# Altium schematic sheet BopIt.SchDoc
size A; SheetNumber: 1; SheetTotal: 1
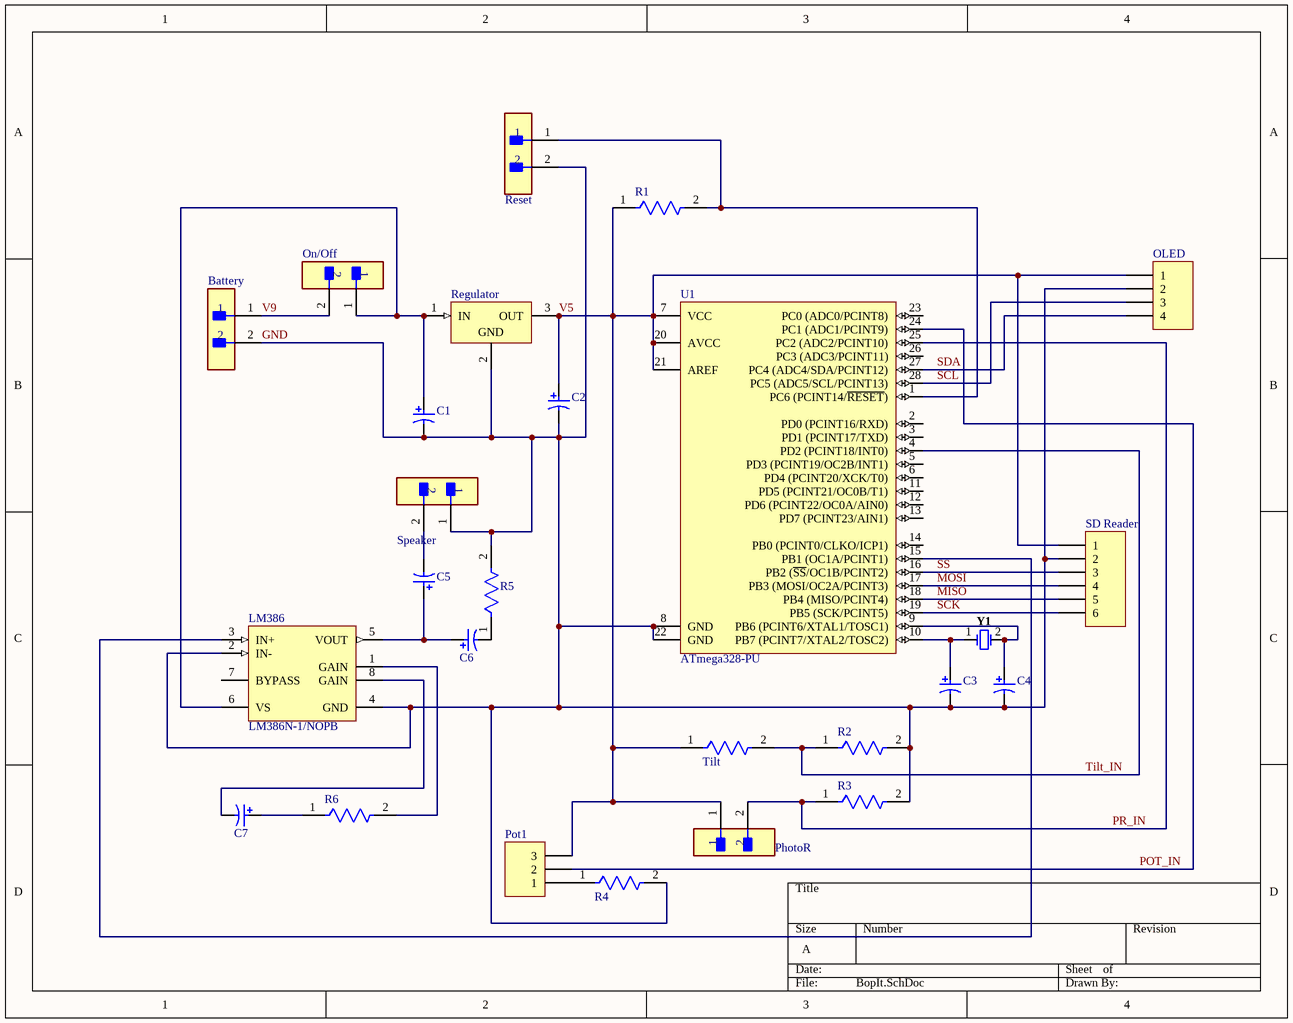
[diagram p0: BopIt.SchDoc]

## Parts
Battery  M22-2510205  [FP-M22-2510205-MFG]  (value not drawn)
C1  ECA1HM100  [CAPPR55-200-1100X500X1200]  (value not drawn)
C2  ECA1HM100  [CAPPR55-200-1100X500X1200]  (value not drawn)
C3  ECA1HM100  [CAPPR55-200-1100X500X1200]  (value not drawn)
C4  ECA1HM100  [CAPPR55-200-1100X500X1200]  (value not drawn)
C5  ECA-1VM221  [PNSC-ECA-1VM221-2]  (value not drawn)
C6  ECA1HM100  [CAPPR55-200-1100X500X1200]  (value not drawn)
C7  ECA1HM100  [CAPPR55-200-1100X500X1200]  (value not drawn)
LM386  LM386N-1/NOPB  [P0008A]
OLED  (no value)  [HDR1X4]
On/Off  M22-2510205  [FP-M22-2510205-MFG]  (value not drawn)
PhotoR  M22-2510205  [FP-M22-2510205-MFG]  (value not drawn)
Pot1  Header 3  [HDR1X3]  (value not drawn)
R1  CF18JT10K0  [FP-CF18-MFG]  (value not drawn)
R2  CF18JT10K0  [FP-CF18-MFG]  (value not drawn)
R3  CF18JT10K0  [FP-CF18-MFG]  (value not drawn)
R4  CF18JT10K0  [FP-CF18-MFG]  (value not drawn)
R5  CF18JT10K0  [FP-CF18-MFG]  (value not drawn)
R6  CF18JT10K0  [FP-CF18-MFG]  (value not drawn)
Regulator  LM7805CT  [FAIR-TO-220-3]  (value not drawn)
Reset  M22-2510205  [FP-M22-2510205-MFG]  (value not drawn)
SD_Reader  Header 6  [HDR1X6]  (value not drawn)
Speaker  M22-2510205  [FP-M22-2510205-MFG]  (value not drawn)
Tilt  CF18JT10K0  [FP-CF18-MFG]  (value not drawn)
U1  ATmega328-PU  [28P3]
Y1  FOXSLF/160-20  [FOX-FOXSLF160-20]  (value not drawn)

## Nets
GND: Battery.2 C1.2 C2.2 C3.2 C4.2 LM386.2(IN-) LM386.4(GND) OLED.2 R2.2 R3.2 R4.2 R5.2 Regulator.2(GND) Reset.2 SD_Reader.2 Speaker.1 U1.8(GND) U1.22(GND)
MISO: SD_Reader.5 U1.18(PB4_(MISO/PCINT4))
MOSI: SD_Reader.4 U1.17(PB3_(MOSI/OC2A/PCINT3))
POT_IN: Pot1.2 U1.24(PC1_(ADC1/PCINT9))
PR_IN: PhotoR.2 R3.1 U1.25(PC2_(ADC2/PCINT10))
SCK: SD_Reader.6 U1.19(PB5_(SCK/PCINT5))
SCL: OLED.3 U1.28(PC5_(ADC5/SCL/PCINT13))
SDA: OLED.4 U1.27(PC4_(ADC4/SDA/PCINT12))
SS: SD_Reader.3 U1.16(PB2_(~{SS}/OC1B/PCINT2))
Tilt_IN: R2.1 Tilt.2 U1.4(PD2_(PCINT18/INT0))
V5: C2.1 OLED.1 PhotoR.1 Pot1.3 R1.1 Regulator.3(OUT) SD_Reader.1 Tilt.1 U1.7(VCC) U1.20(AVCC) U1.21(AREF)
V9: Battery.1 On/Off.2
NetC1_1: C1.1 LM386.6(VS) On/Off.1 Regulator.1(IN)
NetC3_1: C3.1 U1.10(PB7_(PCINT7/XTAL2/TOSC2)) Y1.1
NetC4_1: C4.1 U1.9(PB6_(PCINT6/XTAL1/TOSC1)) Y1.2
NetC5_1: C5.1 C6.1 LM386.5(VOUT)
NetC5_2: C5.2 Speaker.2
NetC6_2: C6.2 R5.1
NetC7_1: C7.1 R6.1
NetC7_2: C7.2 LM386.8(GAIN)
NetLM386_1: LM386.1(GAIN) R6.2
NetLM386_3: LM386.3(IN+) U1.15(PB1_(OC1A/PCINT1))
NetPot1_1: Pot1.1 R4.1
NetR1_2: R1.2 Reset.1 U1.1(PC6_(PCINT14/~{RESET}))

Not connected (* = marked no-connect by the designer): LM386 7(BYPASS); U1 2(PD0_(PCINT16/RXD)) 3(PD1_(PCINT17/TXD)) 5(PD3_(PCINT19/OC2B/INT1)) 6(PD4_(PCINT20/XCK/T0)) 11(PD5_(PCINT21/OC0B/T1)) 12(PD6_(PCINT22/OC0A/AIN0)) 13(PD7_(PCINT23/AIN1)) 14(PB0_(PCINT0/CLKO/ICP1)) 23(PC0_(ADC0/PCINT8)) 26(PC3_(ADC3/PCINT11))

## Library data of the parts
Battery On/Off PhotoR Reset Speaker = CMP-15831-000005-1: CONN HEADER VERT 2POS 2MM; Manufacturer: Harwin; Conn Gender: Male; Current Rating: 2A; Number Of Contacts: 2; Conn Orientation: Vertical; Temperature Range Low: -40°C; Device Class L1: Connectors; ComponentLink2URL: https://cdn.harwin.com/pdfs/C018XX_M22_Series_Connectors.pdf; Temperature Range High: +105°C; Pitch: 2mm; Number Of Rows: 1; Temperature: -40°C to +105°C; Automotive: No; Device Class L3: unset; Octopart: https://octopart.com/m22-2510205-harwin-2538221; Mouser Description: Headers & Wire Housings 2 PIN SIL VERTICAL GOLD PIN HEADER; Height: 5.45mm; Category: Conn; Digikey Description: CONN HEADER VERT 2POS 2MM; Contact Material: Gold,Nickel; Lead Free: Yes; ComponentLink2Description: Datasheet; Manufacturer Part Number: M22-2510205; Device Class L2: Headers and Wire Housings; Package: 0; Footprint Url: https://cdn.harwin.com/pdfs/M22-251.pdf; RoHS: TRUE
C1-C4 C6 C7 = CMP-1665-00038-2: Aluminum Electrolytic Capacitor, 10 uF, +/- 20%, 50 V, -40 to 85 degC, 2-Pin THD, RoHS, Bulk; Manufacturer: Panasonic; Life (Hours): 2000Hour; Lead/Base Style: Straight; Dissipation Factor: 0.12%; Capacitance: 10uF; Leakage Current: 3uA; Dielectric Material: Aluminium; Lead Diameter: 0.5mm; Voltage Rating: 50V; Ripple Current: 65mA; Package Reference: CAPPR55-200-1100X500X1200; Height: 11mm; Diameter: 5mm; REACH SVHC: NoSVHC; Mount: ThroughHole; Packaging: Bulk; Manufacturer URL: http://www.panasonic.com/; Termination: Radial; Datasheet URL: https://industrial.panasonic.com/cdbs/www-data/pdf/RDF0000/ABA0000C1218.pdf; Lead Free: LeadFree; Height - Seated (Max): 0.472inch; Case/Package: Radial; Package Description: 2-Pin Radial Lead, Dia 5 mm, Height 12 mm; Tolerance: 20%; Datasheet Version: Rev. 05, 10/2016; Package Quantity: 200; Ripple Current (AC): 65mA; Min Operating Temperature: -40degC; RoHSCompliant: true; Number of Pins: 2; Max Operating Temperature: 85degC; Voltage: 50V; Lead Pitch: 2mm; Radiation Hardening: No; Voltage Rating (DC): 50V; Length: 11mm
C5 = CMP-2000-05311-1: Aluminum Electrolytic Capacitor, 220 uF, +/- 20%, 35 V, -40 to 85 degC, 2-Pin THD, RoHS, Bulk; Manufacturer: Panasonic; Lifetime@Temperature: 2000Hrs@85degC; Rated Voltage: 35V; Ripple Current: 350mA; Type: Radial; Capacitance: 220µF; Package Reference: ECA-1VM221; Series: M; Operating Temp Range: -40to+85degC; Package Description: 2-Pin Axial Lead, Dia 8 mm, Body Length 12.5 mm; Datasheet Version: Mar-06; Datasheet URL: https://datasheet.ciiva.com/26341/441851-da-01-en-elko-eca1vm221-m-r-220myf-35v-85c-26341906.pdf; Operating Temp-Max: 85degC; Case Size/Dimension: Ø8x11.5mm; Manufacturer URL: http://www.panasonic.com/
LM386 = CMP-0057-00052-4: Low Voltage Audio Power Amplifier, 8-pin MDIP, Pb-Free; Manufacturer: Texas Instruments; PackageTopMarking: NSUZXYTTE#*LM*386N-1; PowerWise: N; CompType: Audio IC; RoHS: Y; PackageReference: P0008A; Code_JEDEC: MS-001-BA; PackageDescription: MDIP, .365 x .250 x .130in, 8 Lead, .100in Pitch; PinCount: 8; ComponentLink1URL: http://www.ti.com/general/docs/lit/getliterature.tsp?genericPartNumber=LM386&fileType=pdf; ComponentLink1Description: Datasheet URL
OLED = Header 4: Header, 4-Pin; LatestRevisionDate: 17-Jul-2002; LatestRevisionNote: Re-released for DXP Platform.; Publisher: Altium Limited
Pot1 = Header 3: Header, 3-Pin; LatestRevisionDate: 17-Jul-2002; LatestRevisionNote: Re-released for DXP Platform.; Publisher: Altium Limited
R1-R6 Tilt = CMP-26528-000002-1: RES 10K OHM 1/8W 5% CF AXIAL; Manufacturer: Stackpole Electronics; Power Rating: 0.125W; Temperature Coefficient: 0-500ppm/°C; Resistance: 10kΩ; Voltage Rating: 250V; Value: 10kΩ; Temperature: -55°C to +155°C; Height: 2mm; Lead Free: Yes; Automotive: No; Device Class L2: Resistors; Package: CF18; Series: CF; ComponentLink2Description: Datasheet; Ipc Land Pattern Name: RESAD656W65L360D200; Manufacturer Part Number: CF18JT10K0; Temperature Range High: +155°C; RoHS: TRUE; Device Class L3: Through-Hole Resistors; Temperature Range Low: -55°C; Device Class L1: Passive Components; Category: Res; Octopart: https://octopart.com/cf18jt10k0-stackpole+electronics-19205642; Composition: Carbon Film; Digikey Description: RES 10K OHM 1/8W 5% CF AXIAL; ComponentLink2URL: http://www.seielect.com/Catalog/SEI-CF_CFM.pdf; Tolerance: 5%
Regulator = CMP-2000-04938-1: Positive Voltage Regulator, 5 V, 1 A, -40 to 125 degC, 3-Pin TO-220, RoHS, Tube; Manufacturer: FairchildSemiconductor; Maximum Input Voltage: 35V; Maximum Quiescent Current: 8mA; Load Regulation: 100mV; Maximum Output Current: 2.2(Typ)A; Output Type: Fixed; Typical Dropout Voltage @ Current: 2@1AV; Rad Hard: No; Output Voltage: 5V; Accuracy: ±4%; Number of Outputs: 1; Category: LinearRegulator; Package Description: 3-Pin Through Hole Device, Body 10 x 4.5 mm, Pitch 2.54 mm; Packaging: Rail/Tube; Mounting: ThroughHole; Polarity: Positive; Manufacturer URL: https://www.fairchildsemi.com/; Line Regulation: 100mV; Datasheet Version: Aug-12; Datasheet URL: https://datasheet.ciiva.com/26904/lm7805ct-26904988.pdf; Package Reference: TO-220; Package URL: https://www.fairchildsemi.com/package-drawings/TO/TO220B03.pdf; Package: 3TO-220AB; Operating Temperature: -40to125degC; Type: Linear
SD_Reader = Header 6: Header, 6-Pin; LatestRevisionDate: 17-Jul-2002; LatestRevisionNote: Re-released for DXP Platform.; Publisher: Altium Limited
U1 = CMP-0095-00015-2: 8-bit AVR Microcontroller, 32KB Flash, 1KB EEPROM, 2KB SRAM, 28-pin PDIP, Industrial Grade (-40°C to 85°C); ComponentLink3Description: ATmega48A/48PA/88A/88PA/168A/168PA/328/328P Summary; RevisionNote: DatasheetVersion updated. URLs added.; DatasheetVersion: revD, May-2011; ComponentLink1URL: http://www.atmel.com/; PackageVersion: revB, Sep-2001; PackageDescription: 28-lead (0.300"/7.62mm Wide) Plastic Dual Inline Package (PDIP); PackageReference: 28P3; ComponentLink1Description: Manufacturer URL; ComponentLink2Description: ATmega48A/48PA/88A/88PA/168A/168PA/328/328P Datasheet; ComponentLink3URL: http://www.atmel.com/dyn/resources/prod_documents/8271S.pdf; ComponentLink2URL: http://www.atmel.com/dyn/resources/prod_documents/8271.pdf
Y1 = CMP-1749-00003-1: Resistance Weld Thru-Hole Crystal, 16 MHz, -20 to 70 degC, 2-Pin THD, RoHS, Bulk; Voltage Rating: 250 V; Tolerance: 1%; Resistance: 221 kohm; Case\Package: Axial; Power Rating: 250 mW; RoHSCompliant: true; Package Quantity: 200; Packaging: Bulk; Min Operating Temperature: -55 degC; DatasheetVersion: Mar-15; ComponentLink1URL: http://www.foxonline.com/; Max Operating Temperature: 155 degC; PackageReference: FOXSLF160-20; Mount: Through Hole; PackageDescription: 2-Pin Through Hole Device, Body 11.35 x 4.65 mm; ComponentLink1Description: Manufacturer URL; ComponentLink2URL: http://www.foxonline.com/pdfs/hc49slf.pdf; ComponentLink2Description: Datasheet; Length: 0.248 inch